# EAGLE design CCM_0000 (EAGLE 6.5.0)
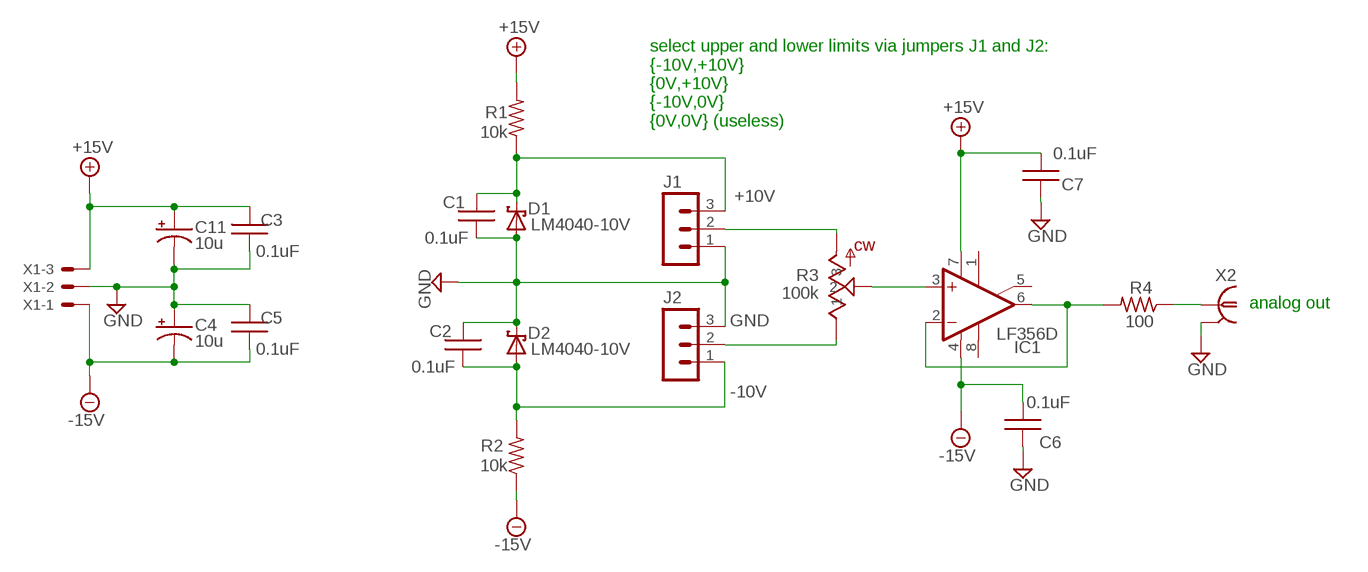
[diagram p0: schematic, sheet 1]

## Parts
C1  0.1uF  CAPACITOR0603  [0603]
C2  0.1uF  CAPACITOR0603  [0603]
C3  0.1uF  CAPACITOR0603  [0603]
C4  10u  CAP_POL1206  [EIA3216]
C5  0.1uF  CAPACITOR0603  [0603]
C6  0.1uF  CAPACITOR0603  [0603]
C7  0.1uF  CAPACITOR0603  [0603]
C11  10u  CAP_POL1206  [EIA3216]
D1  LM4040-10V  LM4040  [SOT23]
D2  LM4040-10V  LM4040  [SOT23]
IC1  LF356D  [SO08]
J1  MA03-1  [MA03-1]
J2  MA03-1  [MA03-1]
R1  10k  RESISTOR0603  [0603]
R2  10k  RESISTOR0603  [0603]
R3  100k  TRIM_US-  [3590]
R4  100  RESISTOR0603  [0603]
X1  22-23-2031  [22-23-2031]
X2  1-227161-0  [AMP_227161]

## Nets
+10V: C1.1 D1.1(C) J1.3 R1.1
+15V: C3.1 C7.2 C11.A(+) IC1.7(V+) R1.2 X1.3
-10V: C2.2 D2.2(A) J2.1 R2.2
-15V: C4.C(-) C5.2 C6.2 IC1.4(V-) R2.1 X1.1
GND: C1.2 C2.1 C3.2 C4.A(+) C5.1 C6.1 C7.1 C11.C(-) D1.2(A) D2.1(C) J1.1 J2.3 X1.2 X2.2
N$1: J1.2 R3.3
N$2: J2.2 R3.1
N$3: R4.1 X2.1
N$4: IC1.2(-IN) IC1.6(OUT) R4.2
N$5: IC1.3(+IN) R3.2
Unconnected: IC1.1(ON1) IC1.5(ON2) IC1.8(OPT)

## Notes on the sheet
- select upper and lower limits via jumpers J1 and J2:
  {-10V,+10V}
  {0V,+10V}
  {-10V,0V}
  {0V,0V} (useless)
- analog out

## Library data of the parts
C1-C3 C5-C7 = Fitch_Passive:CAPACITOR
C4 C11 = SparkFun:CAP_POL: Capacitor Polarized These are standard SMD and PTH capacitors. Normally 10uF, 47uF, and 100uF in electrolytic and tantalum varieties. Always verify the external diameter of the through hole cap, it varies with capacity, voltage, and manufacturer. The EIA devices should be standard.
D1 D2 = Fitch_Library:LM4040: LM4040 Reference Zener Diode
IC1 = linear:LF356: OP AMP
J1 J2 = con-lstb:MA03-1: PIN HEADER; OC_FARNELL: unknown; OC_NEWARK: unknown
R1 R2 R4 = Fitch_Passive:RESISTOR: RESISTOR, American symbol
R3 = Fitch:TRIM_US-: POTENTIOMETER
X1 = con-molex:22-23-2031: .100" (2.54mm) Center Header - 3 Pin; MF: MOLEX; MPN: 22-23-2031; OC_FARNELL: 1462950; OC_NEWARK: 30C0862
X2 = con-coax:?227161*: JACK, RIGHT ANGLE, 50 OHM, PCB, BNC Source: amp_227161.pdf; MF: TYCO ELECTRONICS; MPN: 1-227161; OC_FARNELL: unknown; OC_NEWARK: 33B3200

## Board
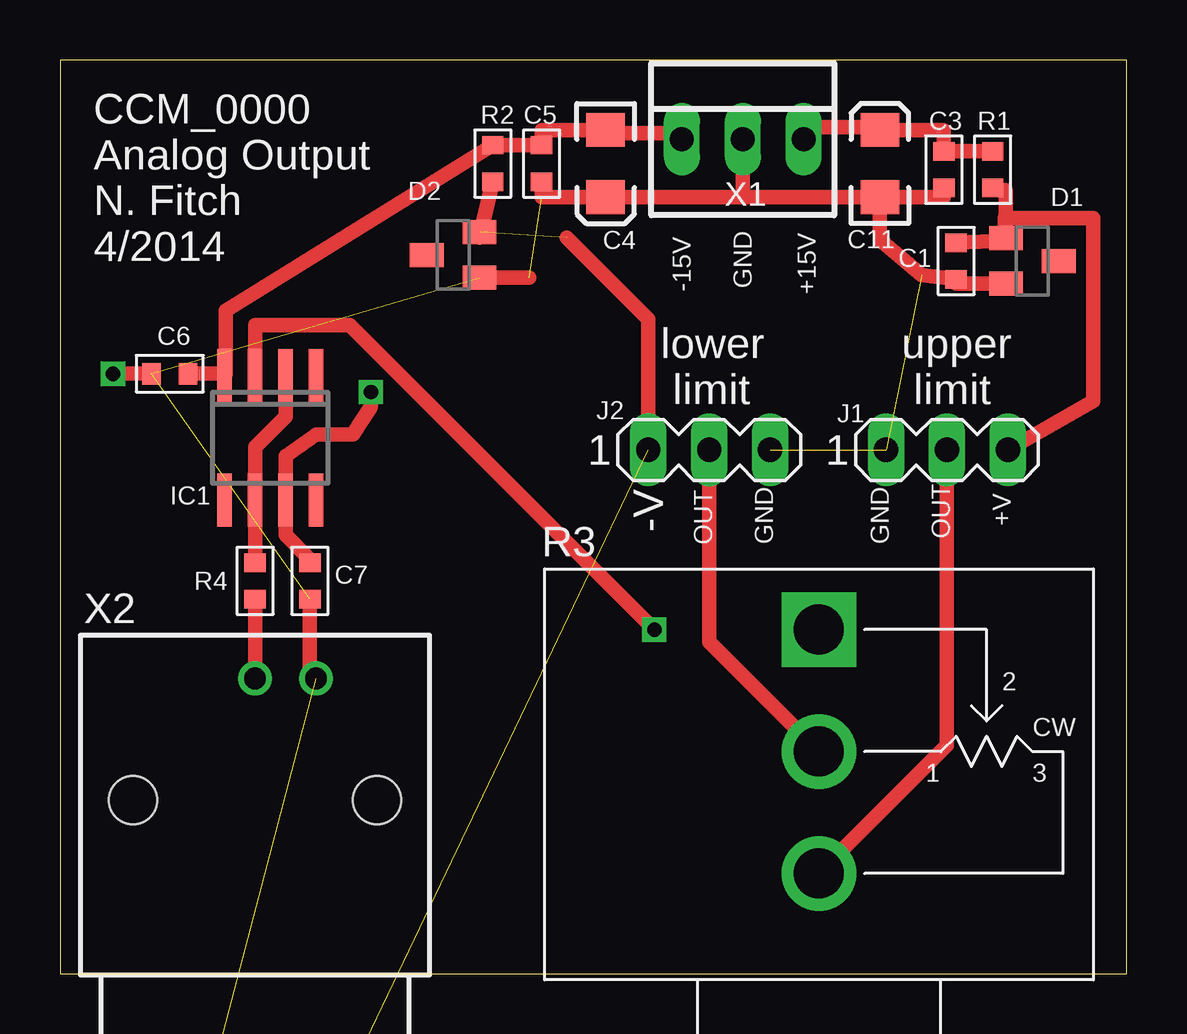
[diagram p1: board, top side]
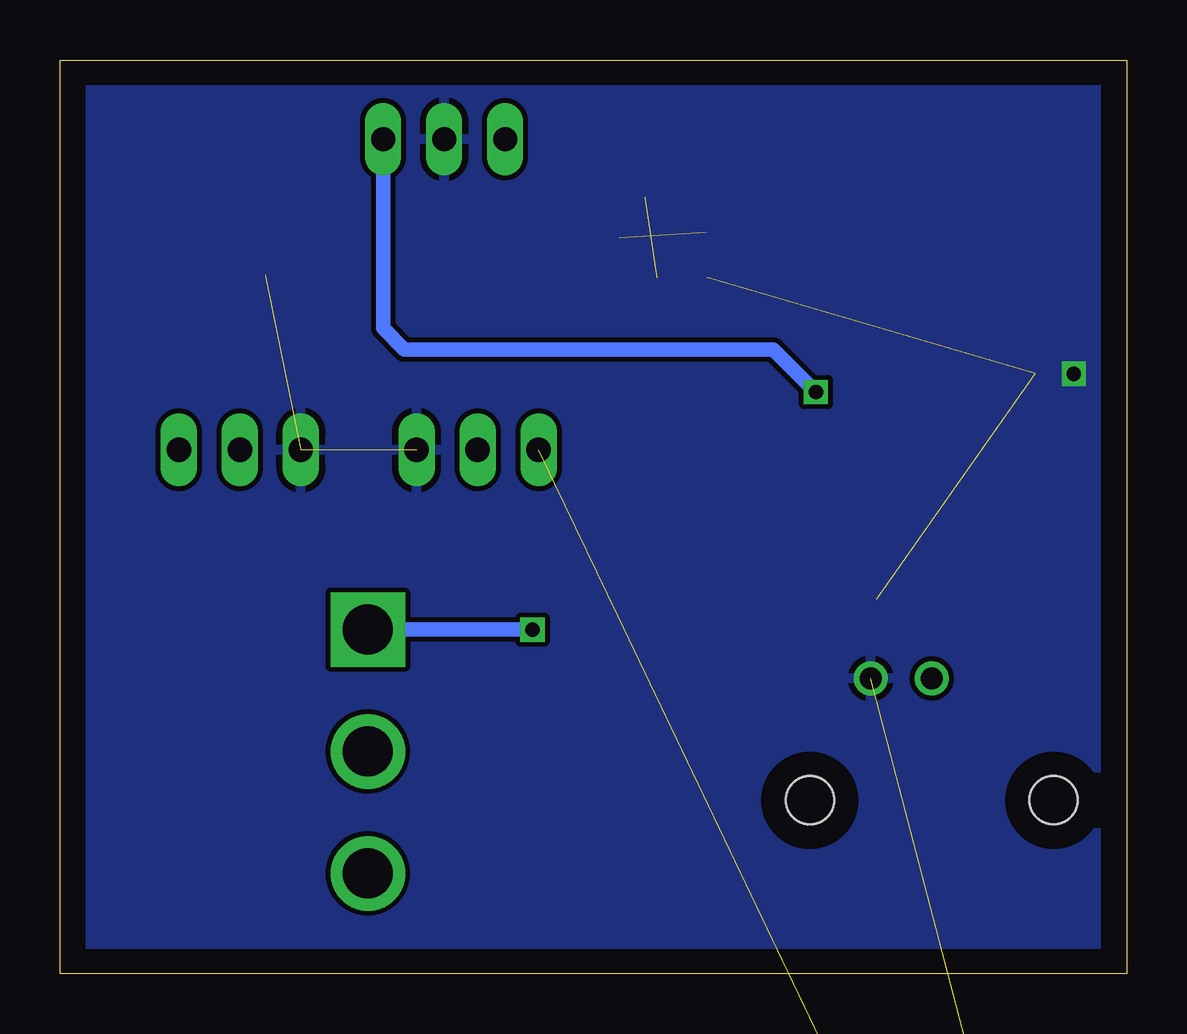
[diagram p2: board, bottom side, seen from below]

Size 44.45 x 38.1 mm. Coordinates in mm from the lower left corner, seen from the top.
Outline: 0,0 44.45,0 44.45,38.1 0,38.1 0,0
Copper layers (1*16): Top 0.035mm / dielectric 1.5mm / Bottom 0.035mm
Design rules "default *": minimum track width 10mil, minimum drill 12mil, track to track 8mil, track to pad 8mil, pad to pad 8mil, via to via 8mil, smd to smd 8mil, copper to edge 40mil, drill to drill 8mil, minimum pad ring 10mil, minimum via ring 8mil, stop-mask expansion 4mil, vias tented up to drill 0mil, thermal gap 10mil

### Footprints (pad centres in the part's own frame; a part is rotated, then mirrored left to right if it is on the bottom)
0603 = smd 0.762 x 0.889: 1 -0.762,0; 2 0.762,0
EIA3216 = smd 1.4 x 1.6: A 1.4,0; C -1.4,0
SOT23 = smd 1 x 1.4: 1 -0.95,-1.1; 2 0.95,-1.1; 3 0,1.1
SO08 = smd 0.6 x 2.2: 1 -1.905,-2.6; 2 -0.635,-2.6; 3 0.635,-2.6; 4 1.905,-2.6; 5 1.905,2.6; 6 0.635,2.6; 7 -0.635,2.6; 8 -1.905,2.6
MA03-1 = drill 1.016 long: 1 -2.54,0; 2 0,0; 3 2.54,0
3590 = drill 2.083: 1 0,0; 3 0,-5.08 | drill 2.083 square: 2 0,5.08
22-23-2031 = drill 1 long: 1 -2.54,0; 2 0,0; 3 2.54,0
AMP_227161 = drill 0.9 pad 1.27: 1 0,-5.08; 2 -2.54,-5.08 | hole 2: -5.08,0; 5.08,0

### Placement (x,y rotation side)
C1  37.34,29.72 270 top
C2  2.03,-23.62 0 top  (outside the outline)
C3  36.83,33.53 270 top
C4  22.73,33.78 270 top
C5  20.07,33.78 90 top
C6  4.57,25.02 0 top
C7  10.41,16.38 90 top
C11  34.16,33.78 90 top
D1  40.51,29.72 270 top
D2  16.38,29.97 90 top
IC1  8.76,22.35 180 top
J1  36.96,21.84 0 top
J2  27.05,21.84 0 top
R1  38.86,33.53 90 top
R2  18.03,33.78 270 top
R3  31.62,9.27 0 top
R4  8.13,16.38 90 top
X1  28.45,34.8 0 top
X2  8.13,7.24 180 top

### Tracks (layer width: path | path; a pad name or v marks a point on that pad's centre or on a via)
+10V
  Top 0.61: R1.1 39.41,32.68 D1.1 39.41,30.57 C1.1 39.37,30.57 39.37,31.5 43.05,31.5 43.05,23.88 J1.3
+15V  (via drill 0.6)
  Top 0.61: X1.3 30.99,35.31 34.16,35.31 C11.A 36.83,35.18 C3.1 R1.2 | C7.2 10.41,17.27 9.4,18.29 IC1.7 9.4,21.59 10.67,22.48 12.19,22.48 12.95,23.62 v12.95,24.26
  Bottom 0.61: X1.3 30.99,26.92 30.1,26.04 14.73,26.04 v12.95,24.26
-10V  (2 unrouted)
  Top 0.61: 17.48,30.7 D2.2 17.53,30.92 R2.2 | 21.12,30.7 24.51,27.3 J2.1
-15V
  Top 0.61: X1.1 25.91,35.05 22.73,35.05 C4.C 20.07,35.18 C5.2 R2.1 6.91,27.65 6.91,25 IC1.4 6.79,25.02 C6.2
GND  (via drill 0.6 pad 0.3)  (6 unrouted)
  Top 0.61: C11.C 36.83,32.38 C3.2 | C11.C 28.45,32.38 | 28.45,32.38 X1.2 | D1.2 37.34,28.77 C1.2 35.9,29.12 34.16,30.61 C11.C | 28.45,32.38 C4.A 20.07,32.38 C5.1 | D2.1 19.56,29.02 | C7.1 10.41,12.57 X2.2 | C6.1 v2.21,25.02
  pour Bottom: 1.27,38.35 43.18,38.35 43.18,0.51 1.27,0.51
N$1
  Top 0.61: J1.2 36.96,9.53 R3.3
N$2
  Top 0.61: J2.2 27.05,13.84 R3.1
N$3
  Top 0.61: R4.1 X2.1
N$4
  Top 0.61: R4.2 IC1.6 8.13,21.97 9.4,23.24 IC1.2
N$5  (via drill 0.6)
  Top 0.61: IC1.3 8.13,27.05 12.06,27.05 v24.77,14.35
  Bottom 0.61: v24.77,14.35 R3.2

### Text on the board
tNames: CCM_0000 / Analog Output / N. Fitch / 4/2014 | GND | -15V | +15V | lower / limit | upper / limit | +V | -V | OUT | GND | GND | OUT